# EAGLE design m232 (EAGLE 9.4.1)
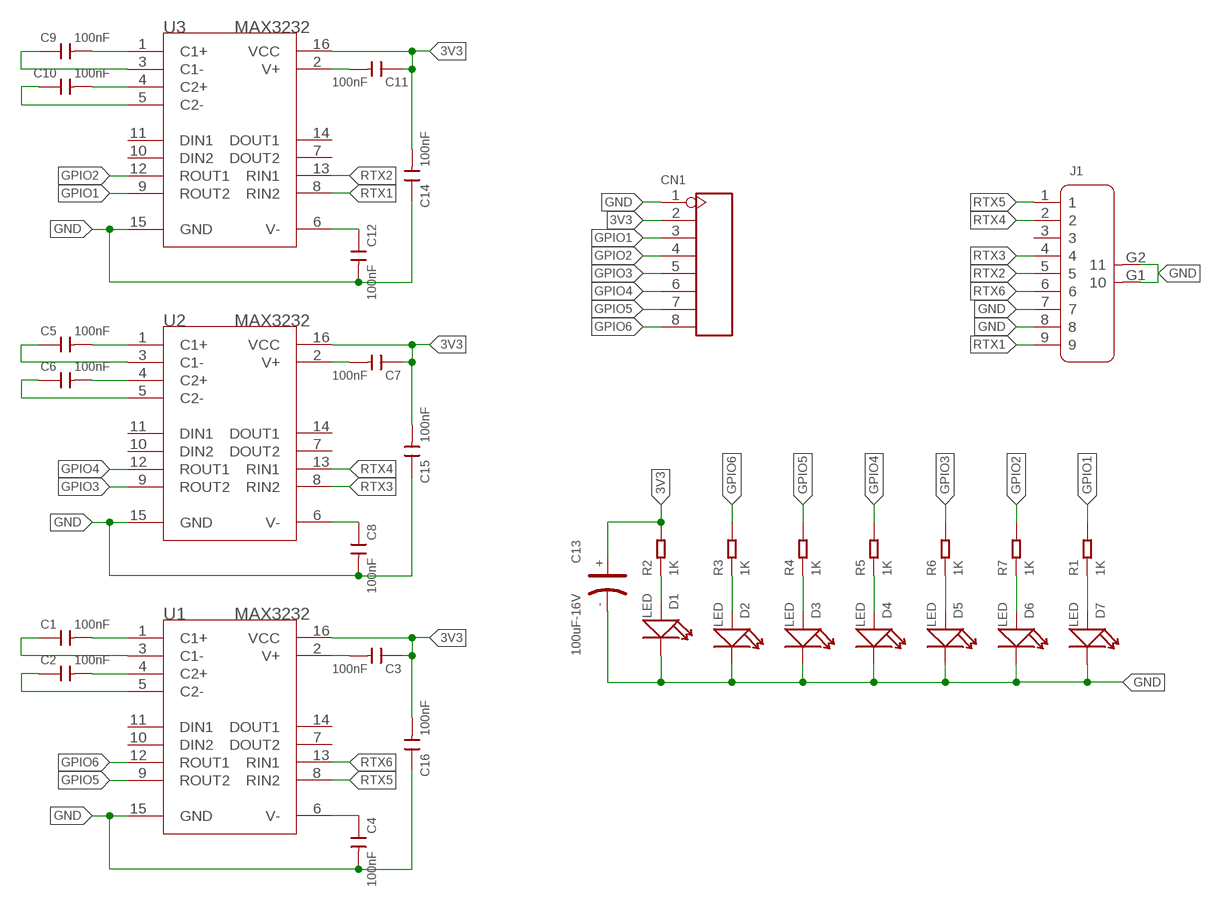
[diagram p0: schematic, sheet 1]

## Parts
C1  100nF  CERAMIC-100NF-50V-10%-X7R(0805)  [C0805]
C2  100nF  CERAMIC-100NF-50V-10%-X7R(0805)  [C0805]
C3  100nF  CERAMIC-100NF-50V-10%-X7R(0805)  [C0805]
C4  100nF  CERAMIC-100NF-50V-10%-X7R(0805)  [C0805]
C5  100nF  CERAMIC-100NF-50V-10%-X7R(0805)  [C0805]
C6  100nF  CERAMIC-100NF-50V-10%-X7R(0805)  [C0805]
C7  100nF  CERAMIC-100NF-50V-10%-X7R(0805)  [C0805]
C8  100nF  CERAMIC-100NF-50V-10%-X7R(0805)  [C0805]
C9  100nF  CERAMIC-100NF-50V-10%-X7R(0805)  [C0805]
C10  100nF  CERAMIC-100NF-50V-10%-X7R(0805)  [C0805]
C11  100nF  CERAMIC-100NF-50V-10%-X7R(0805)  [C0805]
C12  100nF  CERAMIC-100NF-50V-10%-X7R(0805)  [C0805]
C13  100uF-16V  DIP-ALUMINUM-100UF-16V(D5-H7MM)  [PC-D5.3MM]
C14  100nF  CERAMIC-100NF-50V-10%-X7R(0805)  [C0805]
C15  100nF  CERAMIC-100NF-50V-10%-X7R(0805)  [C0805]
C16  100nF  CERAMIC-100NF-50V-10%-X7R(0805)  [C0805]
CN1  DIP-BLACK-FEMALE-HEADER-VERT(8P)  [H8-2.54]
D1  LED  SMD-LED-CLEAR-GREEN(0805)  [LED-0805]
D2  LED  SMD-LED-CLEAR-GREEN(0805)  [LED-0805]
D3  LED  SMD-LED-CLEAR-GREEN(0805)  [LED-0805]
D4  LED  SMD-LED-CLEAR-GREEN(0805)  [LED-0805]
D5  LED  SMD-LED-CLEAR-GREEN(0805)  [LED-0805]
D6  LED  SMD-LED-CLEAR-GREEN(0805)  [LED-0805]
D7  LED  SMD-LED-CLEAR-GREEN(0805)  [LED-0805]
J1  DIP-MALE-DB9-CONNECTOR  [DSUB9+2P-2.77-90D-MALE]
R1  1K  SMD-RES-1K-5%-1/8W(0805)  [R0805]
R2  1K  SMD-RES-1K-5%-1/8W(0805)  [R0805]
R3  1K  SMD-RES-1K-5%-1/8W(0805)  [R0805]
R4  1K  SMD-RES-1K-5%-1/8W(0805)  [R0805]
R5  1K  SMD-RES-1K-5%-1/8W(0805)  [R0805]
R6  1K  SMD-RES-1K-5%-1/8W(0805)  [R0805]
R7  1K  SMD-RES-1K-5%-1/8W(0805)  [R0805]
U1  MAX3232  RECEIVER-MAX232D(SOIC16)  [SOIC16-1.27-10X3.9MM]
U2  MAX3232  RECEIVER-MAX232D(SOIC16)  [SOIC16-1.27-10X3.9MM]
U3  MAX3232  RECEIVER-MAX232D(SOIC16)  [SOIC16-1.27-10X3.9MM]

## Nets
3V3: C3.1 C7.1 C11.1 C13.+ C14.2 C15.2 C16.2 CN1.2 R2.2 U1.16(VCC) U2.16(VCC) U3.16(VCC)
GND: C4.2 C8.2 C12.2 C13.- C14.1 C15.1 C16.1 CN1.1 D1.- D2.- D3.- D4.- D5.- D6.- D7.- J1.7 J1.8 J1.G1 J1.G2 U1.15(GND) U2.15(GND) U3.15(GND)
GPIO1: CN1.3 R1.2 U3.9(ROUT2)
GPIO2: CN1.4 R7.2 U3.12(ROUT1)
GPIO3: CN1.5 R6.2 U2.9(ROUT2)
GPIO4: CN1.6 R5.2 U2.12(ROUT1)
GPIO5: CN1.7 R4.2 U1.9(ROUT2)
GPIO6: CN1.8 R3.2 U1.12(ROUT1)
N$1: C7.2 U2.2(V+)
N$10: C5.2 U2.1(C1+)
N$11: C3.2 U1.2(V+)
N$12: C5.1 U2.3(C1-)
N$13: C1.2 U1.1(C1+)
N$14: C1.1 U1.3(C1-)
N$15: C2.2 U1.4(C2+)
N$16: C2.1 U1.5(C2-)
N$17: C6.2 U2.4(C2+)
N$18: C6.1 U2.5(C2-)
N$19: C11.2 U3.2(V+)
N$20: C9.2 U3.1(C1+)
N$21: C9.1 U3.3(C1-)
N$22: C10.2 U3.4(C2+)
N$23: C10.1 U3.5(C2-)
N$24: D7.+ R1.1
N$25: D1.+ R2.1
N$26: D2.+ R3.1
N$27: D3.+ R4.1
N$28: D4.+ R5.1
N$29: D5.+ R6.1
N$30: D6.+ R7.1
RTX1: J1.9 U3.8(RIN2)
RTX2: J1.5 U3.13(RIN1)
RTX3: J1.4 U2.8(RIN2)
RTX4: J1.2 U2.13(RIN1)
RTX5: J1.1 U1.8(RIN2)
RTX6: J1.6 U1.13(RIN1)
V-: C4.1 U1.6(V-)
V-1: C8.1 U2.6(V-)
V-2: C12.1 U3.6(V-)
Unconnected: J1.3 U1.7(DOUT2) U1.10(DIN2) U1.11(DIN1) U1.14(DOUT1) U2.7(DOUT2) U2.10(DIN2) U2.11(DIN1) U2.14(DOUT1) U3.7(DOUT2) U3.10(DIN2) U3.11(DIN1) U3.14(DOUT1)

## Library data of the parts
C1-C12 C14-C16 = Seeed-OPL-Capacitor:CERAMIC-100NF-50V-10%-X7R(0805): 302010165; MPN: CC0805KRX7R9BB104
C13 = Seeed-OPL-Capacitor:DIP-ALUMINUM-100UF-16V(D5-H7MM): 302030031
CN1 = Seeed-OPL-Connector:DIP-BLACK-FEMALE-HEADER-VERT(8P): 320030061; MPN: F185-1108A1BSYC1
D1-D7 = Seeed-OPL-Diode:SMD-LED-CLEAR-GREEN(0805): 304090057; MPN: 17-215SYGC/S530-E2/TR8
J1 = Seeed-OPL-Connector:DIP-MALE-DB9-CONNECTOR: 320110017
R1-R7 = Seeed-OPL-Resistor:SMD-RES-1K-5%-1/8W(0805): 301010311; MPN: RC0805JR-071KL
U1-U3 = Seeed-OPL-ic:RECEIVER-MAX232D(SOIC16): 310060023

## Board
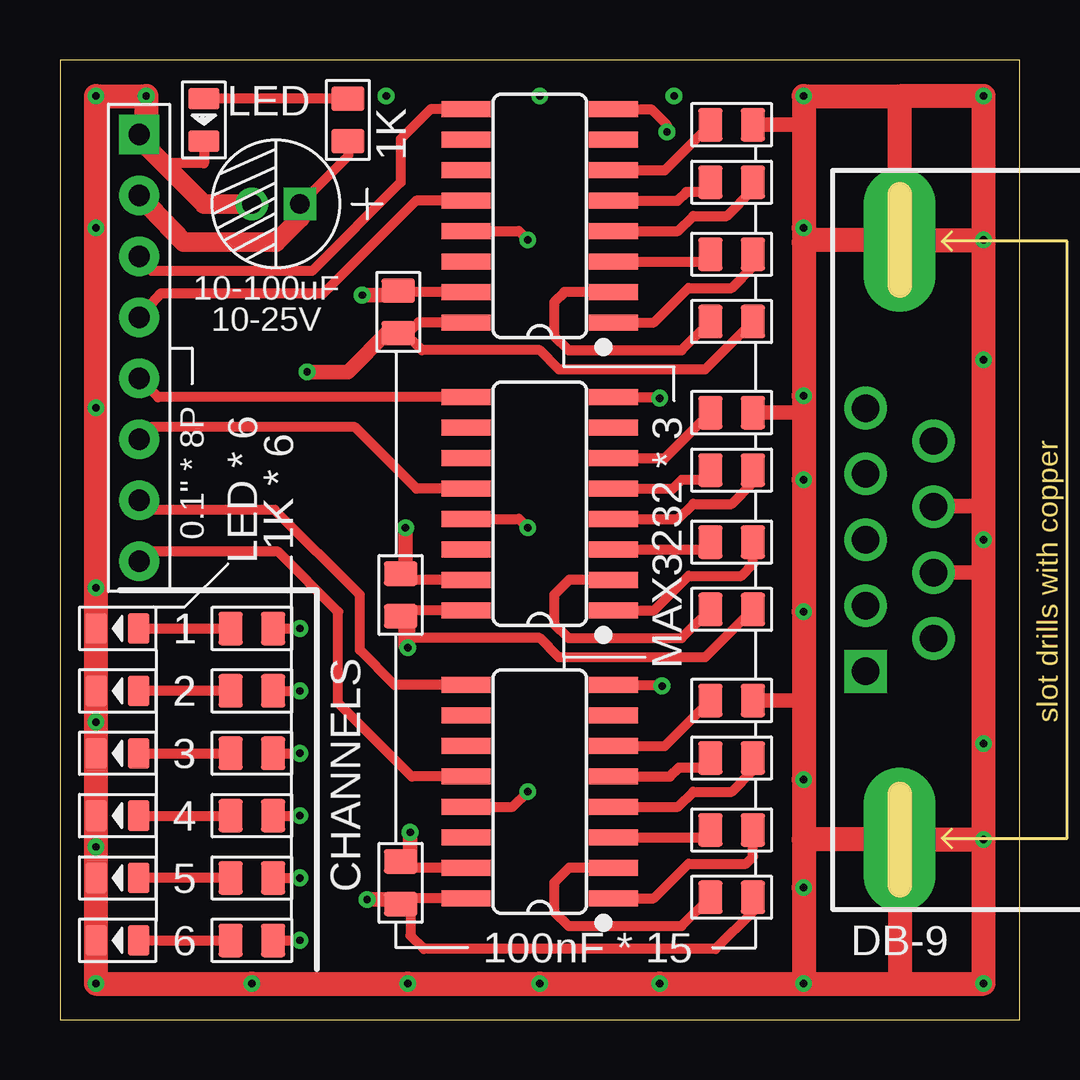
[diagram p1: board, top side]
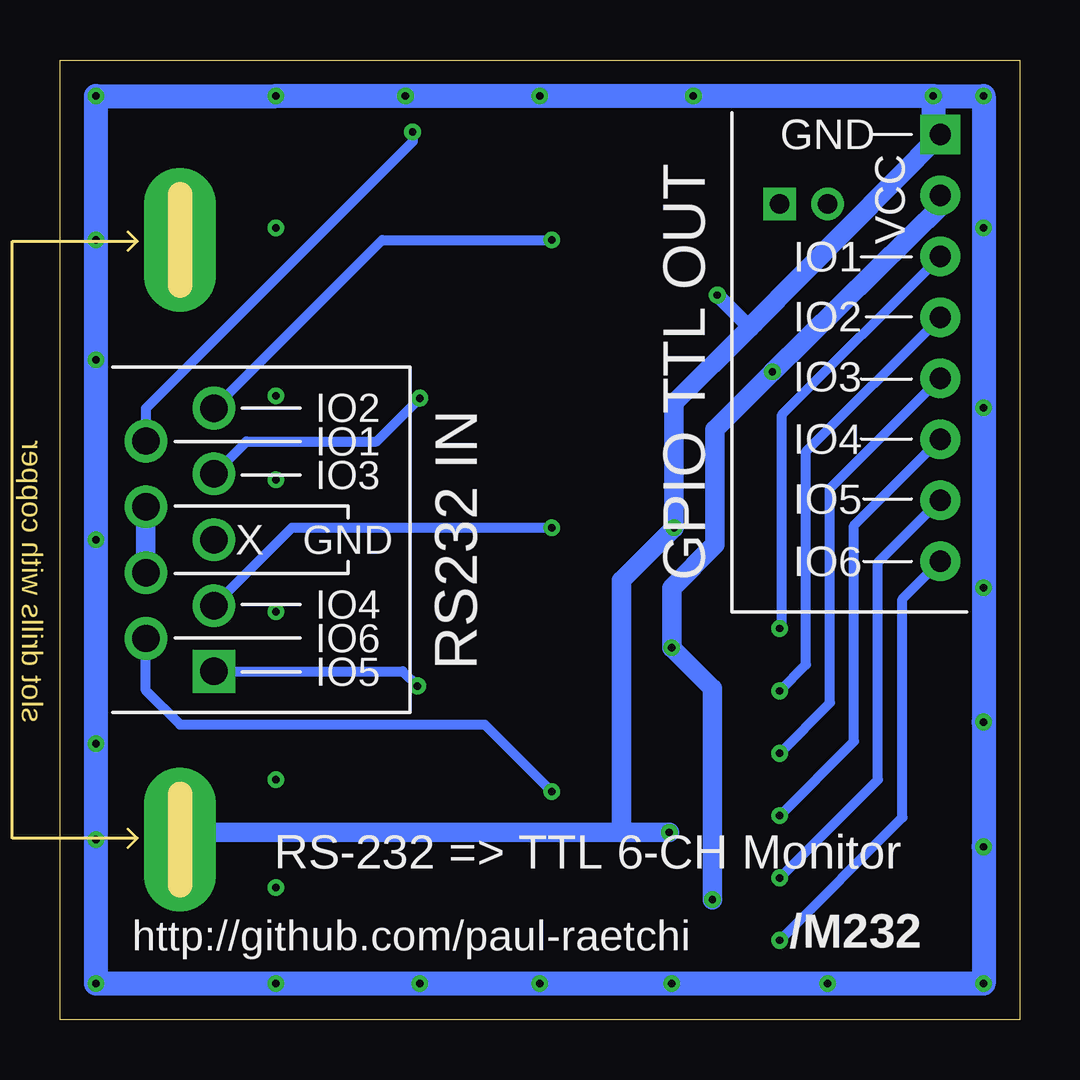
[diagram p2: board, bottom side, seen from below]

Size 40 x 40 mm. Coordinates in mm from the lower left corner, seen from the top.
Outline: 0,0 40,0 40,40 0,40 0,0
Copper layers (1*16): Top 0.035mm / dielectric 1.5mm / Bottom 0.035mm
Design rules "default *": minimum track width 6mil, minimum drill 0.3mm, track to track 6mil, track to pad 6mil, pad to pad 6mil, via to via 6mil, smd to smd 6mil, copper to edge 32mil, drill to drill 6mil, minimum pad ring 10mil, minimum via ring 8mil, stop-mask expansion 4mil, vias tented up to drill 0.3mm, thermal gap 10mil

### Footprints (pad centres in the part's own frame; a part is rotated, then mirrored left to right if it is on the bottom)
C0805 = smd 1.397 x 1.016: 1 0,0.889; 2 0,-0.889
PC-D5.3MM = drill 0.8 pad 1.35 square: + -1,0 | drill 0.8 pad 1.35: - 1,0
H8-2.54 = drill 0.889 pad 1.651 square: 1 0,8.89 | drill 0.889 pad 1.651: 2 0,6.35; 3 0,3.81; 4 0,1.27; 5 0,-1.27; 6 0,-3.81; 7 0,-6.35; 8 0,-8.89
LED-0805 = smd 0.889 x 1.27: + -0.889,0; - 0.889,0
DSUB9+2P-2.77-90D-MALE = drill 1.143 pad 1.778 square: 1 -5.486,1.422 | drill 1.143 pad 1.778: 2 -2.743,1.422; 3 0,1.422; 4 2.743,1.422; 5 5.486,1.422; 6 -4.115,-1.422; 7 -1.372,-1.422; 8 1.372,-1.422; 9 4.115,-1.422 | drill 1 pad 3 long: G1 12.497,0; G2 -12.497,0
R0805 = smd 1.397 x 1.016: 1 0,0.889; 2 0,-0.889
SOIC16-1.27-10X3.9MM = smd 0.66 x 2.032: 1 -4.445,-3.073; 2 -3.175,-3.073; 3 -1.905,-3.073; 4 -0.635,-3.073; 5 0.635,-3.073; 6 1.905,-3.073; 7 3.175,-3.073; 8 4.445,-3.073; 9 4.445,3.073; 10 3.175,3.073; 11 1.905,3.073; 12 0.635,3.073; 13 -0.635,3.073; 14 -1.905,3.073; 15 -3.175,3.073; 16 -4.445,3.073

### Placement (x,y rotation side)
C1  28,7.9 90 top
C2  28,10.9 90 top
C3  28,5.1 270 top
C4  28,13.3 90 top
C5  28,19.9 90 top
C6  28,22.9 90 top
C7  28,17.1 270 top
C8  28,25.3 90 top
C9  28,31.9 90 top
C10  28,34.9 90 top
C11  28,29.1 270 top
C12  28,37.3 90 top
C13  9,34 180 top
C14  14.1,29.5 0 top
C15  14.2,5.7 0 top
C16  14.2,17.7 0 top
CN1  3.3,28 0 top
D1  6,37.5 270 top
D2  2.4,3.3 180 top
D3  2.4,5.9 180 top
D4  2.4,8.5 180 top
D5  2.4,11.1 180 top
D6  2.4,13.7 180 top
D7  2.4,16.3 180 top
J1  35,20 90 top
R1  8,16.3 90 top
R2  12,37.5 0 top
R3  8,3.3 90 top
R4  8,5.9 90 top
R5  8,8.5 90 top
R6  8,11.1 90 top
R7  8,13.7 90 top
U1  20,9.5 90 top
U2  20,21.5 90 top
U3  20,33.5 90 top

### Tracks (layer width: path | path; a pad name or v marks a point on that pad's centre or on a via)
3V3  (via drill 0.3)
  Top 0.406: R2.2 12,36 C13.+ | C3.1 28.89,4.5 27.33,2.94 15.17,2.94 14.61,3.5 14.61,4.4 C15.2 14.44,5.05 U1.16 | C7.1 26.89,15.1 20.8,15.1 20,15.9 14.61,15.9 14.6,15.91 14.6,16.41 C16.2 14.44,17.05 U2.16 | U3.16 14.94,29.05 14.5,28.61 C14.2 | C11.1 26.89,27.1 20.8,27.1 20,27.9 15.09,27.9 14.24,28.75 14.19,28.8
  Top 0.61: v10.3,27 12,27 13.7,28.7 14.09,28.7 14.19,28.8 | 14.24,28.75 C14.2 | C16.2 14.4,16.61 14.4,15.6 v14.5,15.5 | C15.2 14,5.01 v12.81,5.01 v12.8,5
  Top 0.813: CN1.2 5.15,32.4 9,32.4 10,33.4 C13.+
  Bottom 0.813: v12.8,5 12.8,13.8 v14.5,15.5 14.5,18 12.7,19.8 12.7,24.6 v10.3,27 3.2,34 CN1.2
GND  (via drill 0.3)
  Top 0.406: v1.5,18 D7.- D6.- D5.- D4.- 1.4,8.61 1.4,6.01 D3.- 1.4,5.79 1.4,3.1 1.51,3.21 D2.- | D1.- 6,35.69 4.4,35.69 CN1.1 | U1.15 14.46,6.33 C15.1 | U2.15 14.46,18.32 C16.1 | U3.15 14.16,30.32 C14.1
  Top 0.61: v12.6,30.2 12.61,30.19 13.9,30.19 C14.1 | v14.4,20.5 14.4,18.79 C16.1 | v14.6,7.8 14.6,6.99 C15.1 | C8.2 30.9,25.3 31,25.2 | C12.2 30.9,37.3 31,37.2 | C4.2 31,13.3 | J1.8 36.45,21.4 38.5,21.4 | J1.7 38.47,18.63 38.5,18.6
  Top 0.813: C13.- 6,34 3.2,36.8 CN1.1
  Top 1: v31,1.5 v25,1.5 v20,1.5 v14.5,1.5 v8,1.5 v1.5,1.5 v1.5,7.2 v1.5,12.4 v1.5,18 v1.5,25.5 v1.5,33 v1.5,38.5 v3.6,38.5 3.6,37.19 CN1.1 | v31,1.5 35.1,1.5 | 35.1,1.5 v38.5,1.5 v38.5,7.5 | v38.5,7.5 v38.5,11.5 38.5,18.6 v38.5,20 38.5,21.4 v38.5,27.5 v38.5,32.5 | v38.5,32.5 v38.5,38.5 35.1,38.5 | 35.1,38.5 v31,38.5 31,37.2 v31,33 31,32.4 | 31,32.4 v31,26 31,25.2 v31,22.5 v31,17 31,13.3 v31,10 31,7.5 | 31,7.5 v31,5.5 v31,1.5 | J1.G1 31.1,32.5 31,32.4 | J1.G1 v38.5,32.5 | J1.G2 31,7.5 | J1.G2 v38.5,7.5 | J1.G1 35,38.4 35.1,38.5 | J1.G2 35,1.6 35.1,1.5
  Bottom 0.61: v12.6,30.2 11.24,28.84
  Bottom 0.813: CN1.1 11.05,29.05 11.05,29.04 11.24,28.84 14.4,25.69 v14.4,20.5 16.6,18.3 16.6,7.8 v14.6,7.8 34.7,7.8 J1.G2 | J1.7 J1.8
  Bottom 1: v3.6,38.5 v1.5,38.5 v1.5,12.4 v1.5,7.2 v1.5,1.5 v38.5,1.5 v38.5,38.5 v31,38.5 v25.6,38.5 v20,38.5 v13.6,38.5 v3.6,38.5 | v3.6,38.5 3.6,37.2 CN1.1
GPIO1  (via drill 0.3)
  Top 0.406: R1.2 v10,16.3 | U3.9 15.45,37.95 14.2,36.7 14.2,34.9 10.5,31.2 3.81,31.2 CN1.3
  Bottom 0.406: v10,16.3 9.9,16.4 9.9,25.21 CN1.3
GPIO2  (via drill 0.3)
  Top 0.406: R7.2 v10,13.7 | U3.12 14.84,34.13 10.97,30.27 4.2,30.27 CN1.4
  Bottom 0.406: v10,13.7 8.9,14.8 8.9,23.67 CN1.4
GPIO3  (via drill 0.3)
  Top 0.406: R6.2 v10,11.1 | U2.9 4.08,25.95 CN1.5
  Bottom 0.406: v10,11.1 7.9,13.2 7.9,22.13 CN1.5
GPIO4  (via drill 0.3)
  Top 0.406: R5.2 v10,8.5 | U2.12 14.86,22.14 12.3,24.69 3.8,24.69 CN1.6
  Bottom 0.406: v10,8.5 6.9,11.6 6.9,20.59 CN1.6
GPIO5  (via drill 0.3)
  Top 0.406: R4.2 v10,5.9 | U1.9 13.96,13.95 12.5,15.4 12.5,17.7 8.95,21.25 3.7,21.25 CN1.7
  Bottom 0.406: v10,5.9 5.9,10 5.9,19.05 CN1.7
GPIO6  (via drill 0.3)
  Top 0.406: R3.2 v10,3.3 | U1.12 14.66,10.13 11.6,13.2 11.6,17 9.09,19.51 3.7,19.51 CN1.8
  Bottom 0.406: v10,3.3 4.88,8.42 4.88,17.53 CN1.8
N$1
  Top 0.406: U2.2 21.23,18.32 20.6,17.7 20.6,16.5 21.2,15.9 25.91,15.9 C7.2
N$10
  Top 0.406: U2.1 24.75,17.05 26.2,18.5 28.4,18.5 28.89,18.99 C5.2
N$11
  Top 0.406: U1.2 21.23,6.33 20.6,5.7 20.6,4.5 21.2,3.9 25.91,3.9 C3.2
N$12
  Top 0.406: U2.3 26.81,19.59 C5.1
N$13
  Top 0.406: U1.1 24.75,5.05 26.2,6.5 28.6,6.5 28.89,6.79 C1.2
N$14
  Top 0.406: U1.3 26.81,7.59 C1.1
N$15
  Top 0.406: U1.4 25.77,8.87 26.4,9.5 28,9.5 28.89,10.39 C2.2
N$16
  Top 0.406: U1.5 25.43,10.13 25.8,10.5 26.71,10.5 C2.1
N$17
  Top 0.406: U2.4 25.77,20.86 26.4,21.5 28,21.5 28.89,22.39 C6.2
N$18
  Top 0.406: U2.5 25.55,22.14 25.91,22.5 26.71,22.5 C6.1
N$19
  Top 0.406: U3.2 21.02,30.32 20.6,29.9 20.6,28.5 21.2,27.9 25.91,27.9 C11.2
N$20
  Top 0.406: U3.1 24.75,29.05 26.2,30.5 28,30.5 28.89,31.39 C9.2
N$21
  Top 0.406: U3.3 26.81,31.59 C9.1
N$22
  Top 0.406: U3.4 25.77,32.87 26.4,33.5 27.8,33.5 28.89,34.59 C10.2
N$23
  Top 0.406: U3.5 25.75,34.13 26.11,34.5 26.71,34.5 C10.1
N$24
  Top 0.406: D7.+ R1.1
N$25
  Top 0.406: R2.1 D1.+
N$26
  Top 0.406: D2.+ R3.1
N$27
  Top 0.406: R4.1 D3.+
N$28
  Top 0.406: D4.+ R5.1
N$29
  Top 0.406: D5.+ R6.1
N$30
  Top 0.406: R7.1 D6.+
RTX1  (via drill 0.3)
  Top 0.406: U3.8 24.66,37.95 25.3,37.3 v25.3,37
  Bottom 0.406: v25.3,37 25.3,36.6 36.42,25.48 J1.9
RTX2  (via drill 0.3)
  Top 0.406: U3.13 19.14,32.87 v19.5,32.5
  Bottom 0.406: v19.5,32.5 26.56,32.5 J1.5
RTX3  (via drill 0.3)
  Top 0.406: U2.8 24.95,25.95 v25,25.9
  Bottom 0.406: J1.4 32.22,24.1 26.8,24.1 v25,25.9
RTX4  (via drill 0.3)
  Top 0.406: U2.13 19.14,20.86 v19.5,20.5
  Bottom 0.406: v19.5,20.5 30.33,20.5 J1.2
RTX5  (via drill 0.3)
  Top 0.406: U1.8 25.05,13.95 v25.1,13.9
  Bottom 0.406: J1.1 25.71,14.51 v25.1,13.9
RTX6  (via drill 0.3)
  Top 0.406: U1.13 18.86,8.87 v19.5,9.5
  Bottom 0.406: v19.5,9.5 22.3,12.3 35,12.3 36.42,13.72 J1.6
V-
  Top 0.406: U1.6 25.22,11.4 C4.1
V-1
  Top 0.406: U2.6 25.22,23.41 C8.1
V-2
  Top 0.406: U3.6 25.22,35.41 C12.1

### Text on the board
tPlace: LED | 1K | 10-100uF | 10-25V | LED * 6 | 1K * 6 | 0.1" * 8P | MAX3232 * 3 | 1 | 1 | 2 | 2 | 3 | CHANNELS | 4 | 5 | 6 | 100nF * 15 | DB-9
bPlace: GND | VCC | IO1 | IO2 | IO3 | GPIO TTL OUT | IO2 | IO4 | IO1 | IO3 | IO5 | RS232 IN | GND | X | IO6 | IO4 | IO6 | IO5 | RS-232 => TTL 6-CH Monitor | /M232 | http://github.com/paul-raetchi